# EAGLE schematic plank.controller.v0 (EAGLE 5.10)
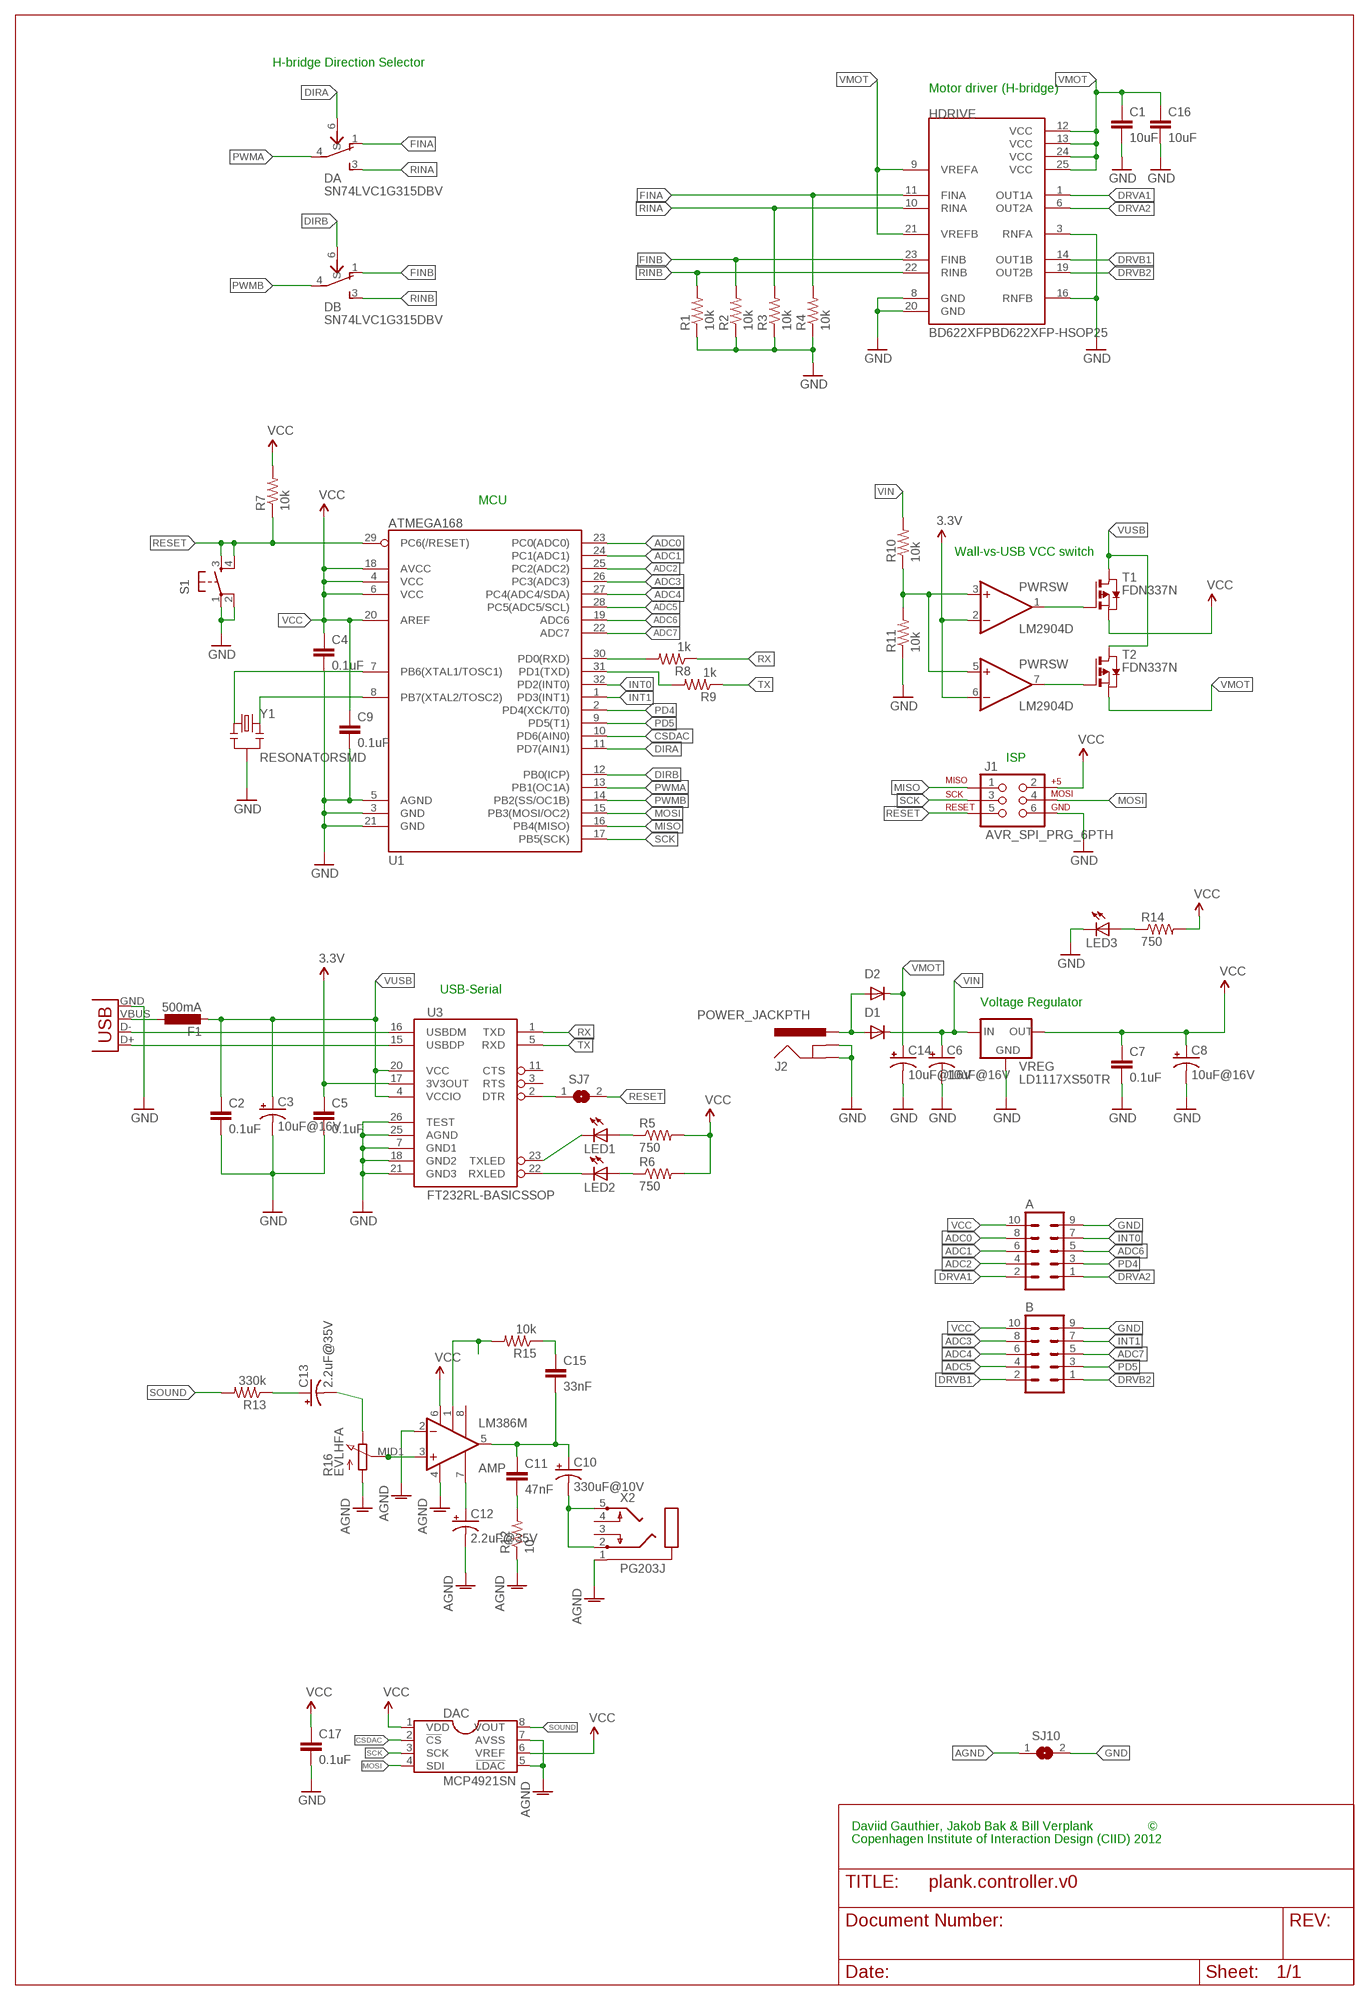
[diagram p0: schematic, sheet 1]

## Parts
A  ML10  [ML10]
AMP  LM386M  [SOIC8]
B  ML10  [ML10]
C1  10uF  CAP0805  [0805]
C2  0.1uF  CAP0603-CAP  [0603-CAP]
C3  10uF@16V  CPOL-USB  [PANASONIC_B]
C4  0.1uF  CAP0805  [0805]
C5  0.1uF  CAP0603-CAP  [0603-CAP]
C6  10uF@16V  CPOL-USB  [PANASONIC_B]
C7  0.1uF  CAP0805  [0805]
C8  10uF@16V  CPOL-USB  [PANASONIC_B]
C9  0.1uF  CAP0805  [0805]
C10  330uF@10V  CPOL-USF  [PANASONIC_F]
C11  47nF  CAP0805  [0805]
C12  2.2uF@35V  CPOL-USA  [PANASONIC_A]
C13  2.2uF@35V  CPOL-USA  [PANASONIC_A]
C14  10uF@16V  CPOL-USB  [PANASONIC_B]
C15  33nF  CAP0805  [0805]
C16  10uF  CAP0805  [0805]
C17  0.1uF  CAP0603-CAP  [0603-CAP]
D1  DIODESMB  [SMB-DIODE]
D2  DIODESMB  [SMB-DIODE]
DA  SN74LVC1G315DBV  [SOT23-6]
DAC  MCP4921SN  [SOIC8]
DB  SN74LVC1G315DBV  [SOT23-6]
F1  500mA  L-EUL1812  [L1812]
HDRIVE  BD622XFPBD622XFP-HSOP25  [HSOP25]
J1  AVR_SPI_PRG_6PTH  [2X3]
J2  POWER_JACKPTH  [POWER_JACK_PTH]
LED1  LED1206  [LED-1206]
LED2  LED1206  [LED-1206]
LED3  LED1206  [LED-1206]
PWRSW  LM2904D  [SOIC8]
R1  10k  RESISTOR0805-RES  [0805]
R2  10k  RESISTOR0805-RES  [0805]
R3  10k  RESISTOR0805-RES  [0805]
R4  10k  RESISTOR0805-RES  [0805]
R5  750  RESISTOR0603-RES  [0603-RES]
R6  750  RESISTOR0603-RES  [0603-RES]
R7  10k  RESISTOR0603-RES  [0603-RES]
R8  1k  RESISTOR0603-RES  [0603-RES]
R9  1k  RESISTOR0603-RES  [0603-RES]
R10  10k  RESISTOR0805-RES  [0805]
R11  10k  RESISTOR0805-RES  [0805]
R12  10  RESISTOR0805-RES  [0805]
R13  330k  RESISTOR0805-RES  [0805]
R14  750  RESISTOR0603-RES  [0603-RES]
R15  10k  RESISTOR0805-RES  [0805]
R16  EVLHFA  [EVLHFA]
S1  TAC_SWITCHSMD  [TACTILE_SWITCH_SMD]
SJ7  SJ  [SJ]
SJ10  SJ  [SJ]
T1  FDN337N  PMOSSOT23  [SOT-23]
T2  FDN337N  PMOSSOT23  [SOT-23]
U1  ATMEGA168  [TQFP32-08]
U3  FT232RL-BASICSSOP  [SSOP28DB]
VREG  LD1117XS50TR  [SOT223]
X1  USB-SMD-NS  [USB-MINIB-NOSTOP]
X2  PG203J  [PG203J]
Y1  RESONATORSMD  [RESONATOR-SMD]

## Nets
3.3V: C5.1 PWRSW.2(-INA) PWRSW.6(-INB) U3.17(3V3OUT)
ADC0: A.8 U1.23(PC0(ADC0))
ADC1: A.6 U1.24(PC1(ADC1))
ADC2: A.4 U1.25(PC2(ADC2))
ADC3: B.8 U1.26(PC3(ADC3))
ADC4: B.6 U1.27(PC4(ADC4/SDA))
ADC5: B.4 U1.28(PC5(ADC5/SCL))
ADC6: A.5 U1.19(ADC6)
ADC7: B.5 U1.22(ADC7)
AGND: AMP.2(-IN) AMP.4(V-) C12.- DAC.5(!LDAC) DAC.7(AVSS) R12.1 R16.CCW SJ10.1 X2.1
CSDAC: DAC.2(!CS) U1.10(PD6(AIN0))
DIRA: DA.6(S) U1.11(PD7(AIN1))
DIRB: DB.6(S) U1.12(PB0(ICP))
DRVA1: A.2 HDRIVE.1(OUT1A)
DRVA2: A.1 HDRIVE.6(OUT2A)
DRVB1: B.2 HDRIVE.14(OUT1B)
DRVB2: B.1 HDRIVE.19(OUT2B)
FINA: DA.1(INA) HDRIVE.11(FINA) R4.2
FINB: DB.1(INA) HDRIVE.23(FINB) R2.2
GND: A.9 B.9 C1.2 C2.2 C3.- C4.2 C5.2 C6.- C7.2 C8.- C9.2 C14.- C16.2 C17.2 HDRIVE.3(RNFA) HDRIVE.8(GND) HDRIVE.16(RNFB) HDRIVE.20(GND) J1.6 J2.GND J2.GNDBREAK LED3.C R1.1 R2.1 R3.1 R4.1 R11.1 S1.1 S1.2 SJ10.2 U1.3(GND) U1.5(AGND) U1.21(GND) U3.7(GND1) U3.18(GND2) U3.21(GND3) U3.25(AGND) U3.26(TEST) VREG.1(GND) X1.GND Y1.2
INT0: A.7 U1.32(PD2(INT0))
INT1: B.7 U1.1(PD3(INT1))
MISO: J1.1 U1.16(PB4(MISO))
MOSI: DAC.4(SDI) J1.4 U1.15(PB3(MOSI/OC2))
N$1: U1.7(PB6(XTAL1/TOSC1)) Y1.1
N$2: U1.8(PB7(XTAL2/TOSC2)) Y1.3
N$3: U3.16(USBDM) X1.D-
N$4: U3.15(USBDP) X1.D+
N$5: LED1.C U3.23(TXLED)
N$6: LED2.C U3.22(RXLED)
N$7: LED1.A R5.1
N$8: LED2.A R6.1
N$9: F1.1 X1.VBUS
N$10: R8.2 U1.30(PD0(RXD))
N$11: R9.2 U1.31(PD1(TXD))
N$12: AMP.3(+IN) R16.MID1 R16.MID2
N$13: PWRSW.3(+INA) PWRSW.5(+INB) R10.1 R11.2
N$14: PWRSW.1(OUTA) T1.3(G)
N$15: LED3.A R14.1
N$16: SJ7.1 U3.2(DTR)
N$18: C13.+ R13.1
N$19: AMP.5(OUT) C10.+ C11.1 C15.2
N$20: C10.- X2.2 X2.5
N$21: C11.2 R12.2
N$23: C15.1 R15.1
N$24: AMP.1(G1) R15.2
N$25: PWRSW.7(OUTB) T2.3(G)
N$71: AMP.7(BYPASS) C12.+
PD4: A.3 U1.2(PD4(XCK/T0))
PD5: B.3 U1.9(PD5(T1))
PWMA: DA.4(OUT) U1.13(PB1(OC1A))
PWMB: DB.4(OUT) U1.14(PB2(SS/OC1B))
RESET: J1.5 R7.1 S1.3 S1.4 SJ7.2 U1.29(PC6(/RESET))
RINA: DA.3(INB) HDRIVE.10(RINA) R3.2
RINB: DB.3(INB) HDRIVE.22(RINB) R1.2
RX: R8.1 U3.1(TXD)
SCK: DAC.3(SCK) J1.3 U1.17(PB5(SCK))
SIN: C13.- R16.CW
SOUND: DAC.8(VOUT) R13.2
TX: R9.1 U3.5(RXD)
VCC: A.10 AMP.6(V+) B.10 C4.1 C7.1 C8.+ C9.1 C17.1 DAC.1(VDD) DAC.6(VREF) J1.2 R5.2 R6.2 R7.2 R14.2 T1.2(S) U1.4(VCC) U1.6(VCC) U1.18(AVCC) U1.20(AREF) VREG.2(OUT)
VIN: C6.+ D1.C R10.2 VREG.3(IN)
VMOT: C1.1 C14.+ C16.1 D2.C HDRIVE.9(VREFA) HDRIVE.12(VCC) HDRIVE.13(VCC) HDRIVE.21(VREFB) HDRIVE.24(VCC) HDRIVE.25(VCC) T2.2(S)
VUSB: C2.1 C3.+ F1.2 T1.1(D) T2.1(D) U3.4(VCCIO) U3.20(VCC)
VWALL: D1.A D2.A J2.PWR
Unconnected: AMP.8(G2) DA.2(GND) DA.5(VCC) DB.2(GND) DB.5(VCC) HDRIVE.GND@1(GND) HDRIVE.GND@2(GND) U3.3(RTS) U3.11(CTS) VREG.4(GND) X2.3 X2.4

## Notes on the sheet
- H-bridge Direction Selector
- Motor driver (H-bridge)
- MCU
- Wall-vs-USB VCC switch
- ISP
- USB-Serial
- Voltage Regulator
- Daviid Gauthier, Jakob Bak & Bill Verplank | ©
- Copenhagen Institute of Interaction Design (CIID) 2012

## Power pins joined to a net without a drawn wire
GND: PWRSW.4(GND)
VCC: PWRSW.8(VCC)

## Library data of the parts
A B = con-harting-ml:ML10: HARTING
AMP = dviiid:LM386: The LM386 is a power amplifier designed for use in low voltage consumer applications.
C1 C2 C4 C5 C7 C9 C11 C15-C17 = SparkFun:CAP: Capacitor Standard 0603 ceramic capacitor, and 0.1" leaded capacitor.
C3 C6 C8 C10 C12-C14 = rcl:CPOL-US: POLARIZED CAPACITOR, American symbol
D1 D2 = SparkFun:DIODE: Diode These are standard reverse protection diodes and small signal diodes. SMA package can handle up to about 1A. SOD-323 can handle about 200mA. What the SOD-323 package when ordering, there are some mfgs out there that are 5-pin packages.
DA DB = dviiid:SN74LVC1G315: This single-pole, double-throw (SPDT) analog switch is designed for 1.65-V to 5.5-V V CC operation. The SN74LVC1G3157 can handle both analog and digital signals. The device permits signals with amplitudes of up to V CC (peak) to be transmitted in either direction. Applications include signal gating, chopping, modulation or demodulation (modem), and signal multiplexing for analog-to-digital and digital-to-analog conversion systems.
DAC = dviiid:MCP4921
F1 = rcl:L-EU: INDUCTOR, European symbol
HDRIVE = dviiid:BD622XFP: Full H-bridge driver - 2 channel - PWM control
J1 = SparkFun:AVR_SPI_PRG_6: AVR ISP 6 Pin This is the reduced ISP connector for AVR programming. Common on Arduino. This footprint will take up less PCB space and can be used with a 10-pin to 6-pin adapter such as SKU: BOB-08508
J2 = SparkFun:POWER_JACK: Power Jack This is the standard 5.5mm barrel jack for power. The PTH is the most common, proven, reliable, footprint. All others are experimental. The Slot footprint only works if the mill layer is transmitted to the PCB fab house so be warned. Spark Fun Electronics SKU : PRT-00119. Mating wall wart : TOL-00298 (and others)
LED1-LED3 = SparkFun:LED: LEDs Standard schematic elements and footprints for 5mm, 3mm, 1206, and 0603 sized LEDs. 5mm - Spark Fun Electronics SKU : COM-00529 (and others)
PWRSW = dviiid:LM2904: Low power dual operational amplifier.
R1-R15 = SparkFun:RESISTOR: Resistor Basic schematic elements and footprints for 0603, 1206, and PTH resistors.
R16 = videomusik:EVLHFA
S1 = SparkFun:TAC_SWITCH: Momentary Switch Button commonly used for reset or general input. Spark Fun Electronics SKU : COM-00097
SJ7 SJ10 = jumper:SJ: SMD solder JUMPER
T1 T2 = zetex:PMOSSOT23: MOS FET
U1 = SparkFun:ATMEGA168
U3 = SparkFun:FT232RL-BASIC: USB UART This is the simplified version of the FT232RL unit. Only what you need, nothing you don't. Spark Fun Electronics SKU : COM-00650
VREG = dviiid:LD1117X: Adjustable and fixed low drop positive voltage regulator
X1 = SparkFun:USB: USB Connectors USB-B-PTH is fully proven SKU : PRT-00139 USB-miniB is fully proven SKU : PRT-00587 USB-A-PCB is untested. USB-A-H is throughly reviewed, but untested. Spark Fun Electronics SKU : PRT-00437 USB-B-SMT is throughly reviewed, but untested. Needs silkscreen touching up. USB-A-S has not been used/tested USB-MB-H has not been used/tested
X2 = con-hirschmann:PG203J: MIC/HEADPHONE JACK KS-S stereo microphone/headphone jack PG203JN (Schukat)
Y1 = SparkFun:RESONATOR: Resonator Small SMD resonator. This is the itty bitty 10/20MHz resonators with built in caps. CSTCE10M0G55 and CSTCE20M0V53. Footprint has been reviewed closely but hasn't been tested yet.